# Altium schematic sheet 00_RPi-GS-CAM-SER_V1-0.SchDoc: RPi GS CAM SER.
size A3; Date: 2023-05-29; Author: M. Weimann; Organization: Altium Limited; Revision: 1.0; SheetNumber: 1; SheetTotal: 5; Title_Subtitle: Block Diagramm; Language: DE; Department: F&E; Filename: RPi-GS-CAM-SER_PCB_V1-0.PDF; Project: PI-0017; DocType: Stromlauf; ItemNo-PCB: n/a
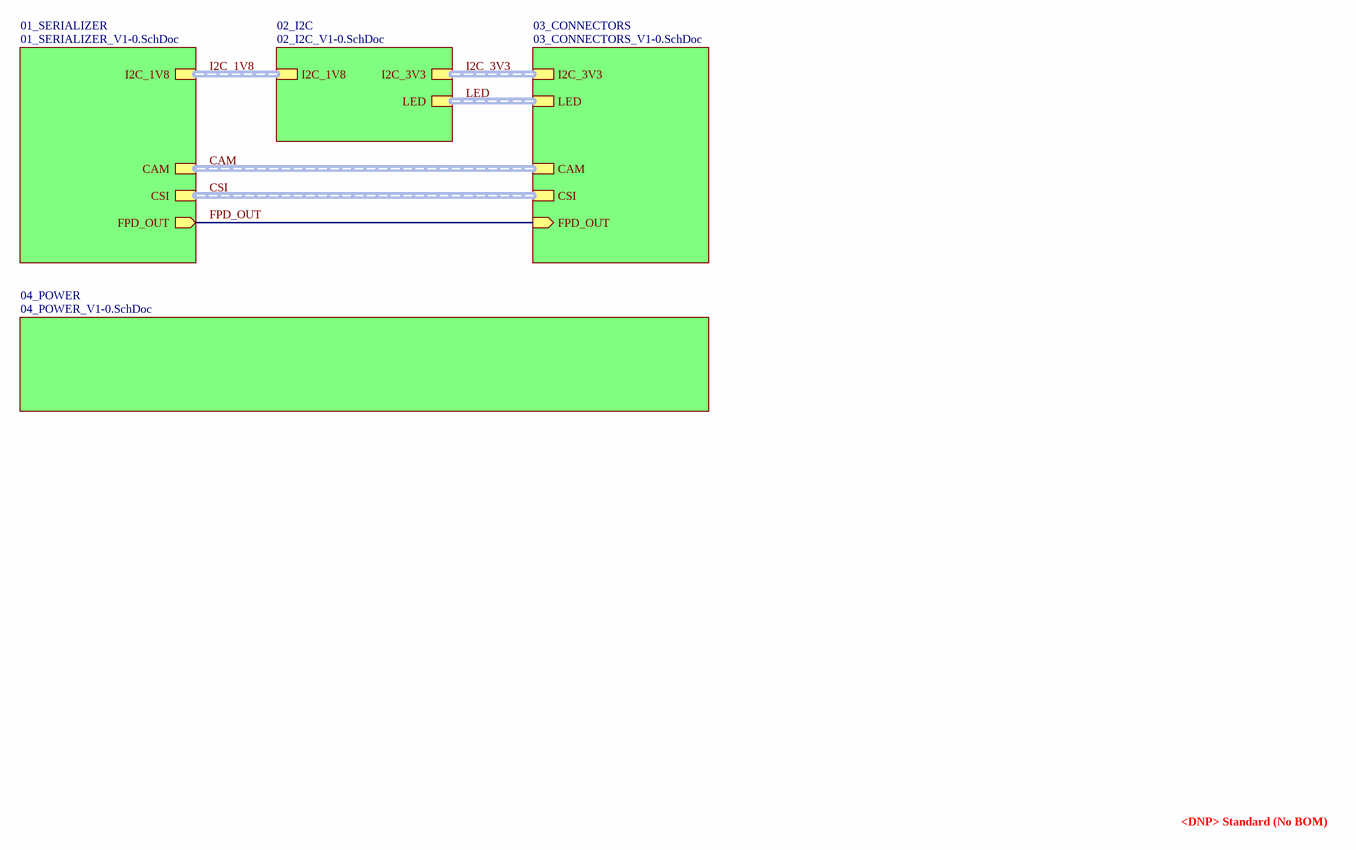
[diagram p0: 00_RPi-GS-CAM-SER_V1-0.SchDoc]

## Sub-sheets
01_SERIALIZER = 01_SERIALIZER_V1-0.SchDoc: CSI (harness CSI), I2C_1V8 (harness I2C_1V8), CAM (harness CAM), FPD_OUT (out)
02_I2C = 02_I2C_V1-0.SchDoc: LED (harness LED), I2C_3V3 (harness I2C_3V3), I2C_1V8 (harness I2C_1V8)
03_CONNECTORS = 03_CONNECTORS_V1-0.SchDoc: FPD_OUT (in), I2C_3V3 (harness I2C_3V3), LED (harness LED), CSI (harness CSI), CAM (harness CAM)
04_POWER = 04_POWER_V1-0.SchDoc: no entries

## Nets
FPD_OUT: sheet 01_SERIALIZER/FPD_OUT, sheet 03_CONNECTORS/FPD_OUT

## Buses and harness runs
harness CAM = sheet 01_SERIALIZER/CAM = sheet 03_CONNECTORS/CAM
harness CSI = sheet 01_SERIALIZER/CSI = sheet 03_CONNECTORS/CSI
harness I2C_1V8 = sheet 01_SERIALIZER/I2C_1V8 = sheet 02_I2C/I2C_1V8
harness I2C_3V3 = sheet 02_I2C/I2C_3V3 = sheet 03_CONNECTORS/I2C_3V3
harness LED = sheet 02_I2C/LED = sheet 03_CONNECTORS/LED

## Notes on the sheet
- <DNP> Standard (No BOM)
- Erstellt von
- Dateiname
- ++CONFIDENTIAL++
- PCB Arts GmbH
- Dokumententyp
- Artikel-Nummer (PCB)
- Kurgartenstraße 59
- 90762 Fürth
- Elektronik- und Softwareentwicklung
- Titel, Sub-Titel
- Projekt
- Rev.
- Datum
- Sprache
- Seite
- The  information  contained  in  these  documents  is  confidential,  privileged  and  only  for  the
  information of the intended recipient and may
  not be used, published or redistributed without
  the prior written consent from PCB Arts GmbH.
- https://pcb-arts.com/
- mail@pcb-arts.com